# EAGLE design Servo_tester_rev1 (EAGLE 9.5.2)
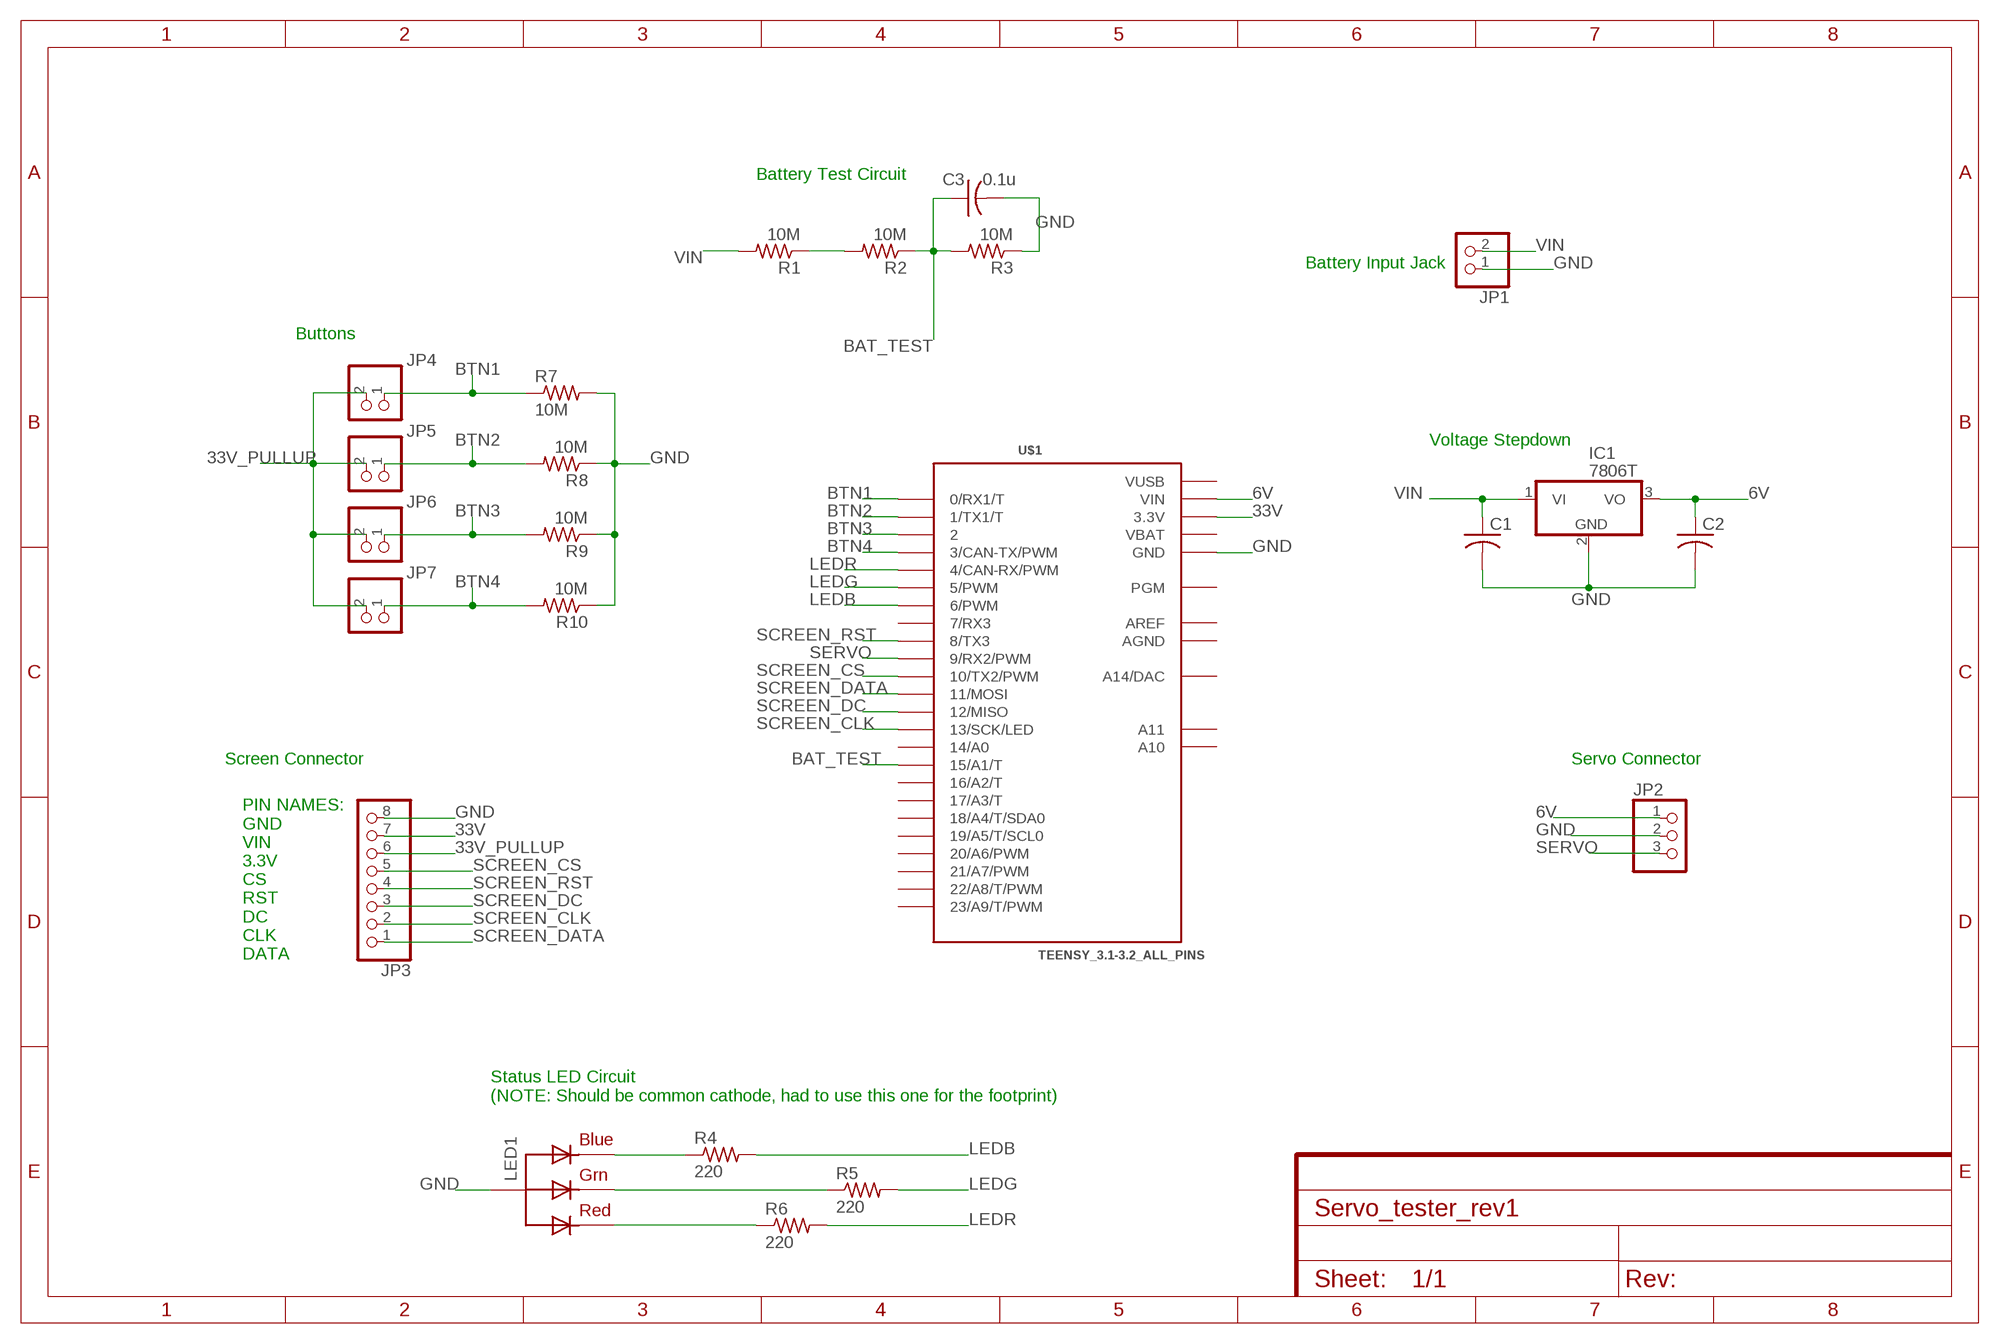
[diagram p0: schematic, sheet 1]

## Parts
C1  C-US050-024X044  [C050-024X044]
C2  C-US050-024X044  [C050-024X044]
C3  0.1u  C-US050-024X044  [C050-024X044]
IC1  7806T  [TO220H]
JP1  HEADER-1X2ROUND  [1X02_ROUND]
JP2  HEADER-1X3ROUND  [1X03_ROUND]
JP3  HEADER-1X870MIL  [1X08_ROUND_70]
JP4  HEADER-1X2ROUND  [1X02_ROUND]
JP5  HEADER-1X2ROUND  [1X02_ROUND]
JP6  HEADER-1X2ROUND  [1X02_ROUND]
JP7  HEADER-1X2ROUND  [1X02_ROUND]
LED1  RGBLED_CA-5MM  [LED5MMRGB]
R1  10M  R-US_0204/5  [0204/5]
R2  10M  R-US_0204/5  [0204/5]
R3  10M  R-US_0204/5  [0204/5]
R4  220  R-US_0204/5  [0204/5]
R5  220  R-US_0204/5  [0204/5]
R6  220  R-US_0204/5  [0204/5]
R7  10M  R-US_0204/5  [0204/5]
R8  10M  R-US_0204/5  [0204/5]
R9  10M  R-US_0204/5  [0204/5]
R10  10M  R-US_0204/5  [0204/5]
U$1  TEENSY_3.1-3.2_ALL_PINS  [TEENSY_3.0-3.2&LC_ALL_PINS]

## Nets
6V: C2.1 IC1.3(VO) JP2.1 U$1.VIN
33V: JP3.7 U$1.3.3V U$1.3.3V1(3.3V)
33V_PULLUP: JP3.6 JP4.2 JP5.2 JP6.2 JP7.2
BAT_TEST: C3.1 R2.1 R3.2 U$1.15/A1(15/A1/T)
BTN1: JP4.1 R7.1 U$1.0(0/RX1/T)
BTN2: JP5.1 R8.2 U$1.1(1/TX1/T)
BTN3: JP6.1 R9.2 U$1.2
BTN4: JP7.1 R10.2 U$1.3(3/CAN-TX/PWM)
GND: C1.2 C2.2 C3.2 IC1.2(GND) JP1.1 JP2.2 JP3.8 LED1.2(VCC) R3.1 R7.2 R8.1 R9.1 R10.1 U$1.GND U$1.GND1(GND)
LEDB: R4.2 U$1.6(6/PWM)
LEDG: R5.2 U$1.5(5/PWM)
LEDR: R6.2 U$1.4(4/CAN-RX/PWM)
N$13: LED1.1(RED) R6.1
N$14: LED1.4(BLUE) R4.1
N$15: LED1.3(GREEN) R5.1
N$19: R1.1 R2.2
SCREEN_CLK: JP3.2 U$1.13(13/SCK/LED)
SCREEN_CS: JP3.5 U$1.10(10/TX2/PWM)
SCREEN_DATA: JP3.1 U$1.11(11/MOSI)
SCREEN_DC: JP3.3 U$1.12(12/MISO)
SCREEN_RST: JP3.4 U$1.8(8/TX3)
SERVO: JP2.3 U$1.9(9/RX2/PWM)
VIN: C1.1 IC1.1(VI) JP1.2 R1.2
Unconnected: U$1.7(7/RX3) U$1.14/A0 U$1.16/A2(16/A2/T) U$1.17/A3(17/A3/T) U$1.18/A4(18/A4/T/SDA0) U$1.19/A5(19/A5/T/SCL0) U$1.20/A6(20/A6/PWM) U$1.21/A7(21/A7/PWM) U$1.22/A8(22/A8/T/PWM) U$1.23/A9(23/A9/T/PWM) U$1.A10 U$1.A11 U$1.PGM U$1.RESET/DAC(A14/DAC)

## Notes on the sheet
- Battery Test Circuit
- Battery Input Jack
- Buttons
- Voltage Stepdown
- Screen Connector | Servo Connector
- PIN NAMES:
  GND
  VIN
  3.3V
  CS
  RST
  DC
  CLK
  DATA
- Status LED Circuit
  (NOTE: Should be common cathode, had to use this one for the footprint)

## Power pins joined to a net without a drawn wire
AGND: U$1.AGND
AREF: U$1.AREF
VBAT: U$1.VBAT
VUSB: U$1.VUSB

## Library data of the parts
C1-C3 = adafruit:C-US: CAPACITOR, American symbol
IC1 = adafruit:78*: Positive VOLTAGE REGULATOR Added bigger pads to the TO-92 package
JP1 JP4-JP7 = microbuilder:HEADER-1X2: PIN HEADER
JP2 = microbuilder:HEADER-1X3: PIN HEADER
JP3 = microbuilder:HEADER-1X8: PIN HEADER
LED1 = adafruit:RGBLED_CA: RGB LED, common-anode 5MM Staggered pins 5mm Piranha package http://www.ladyada.net/library/pcb/eaglelibrary.html
R1-R10 = adafruit:R-US_: RESISTOR, American symbol
U$1 = Teensy_3_and_LC_Series_Boards_v1.4:TEENSY_3.1-3.2_ALL_PINS: Footprint for Teensy 3.1 or 3.2 board using all through-holes, i.e. the entire perimeter plus the 4 through-holes inboard (A10,A11,AREF, VUSB)

## Net classes
0 default: clearance 0.205 mm

## Board
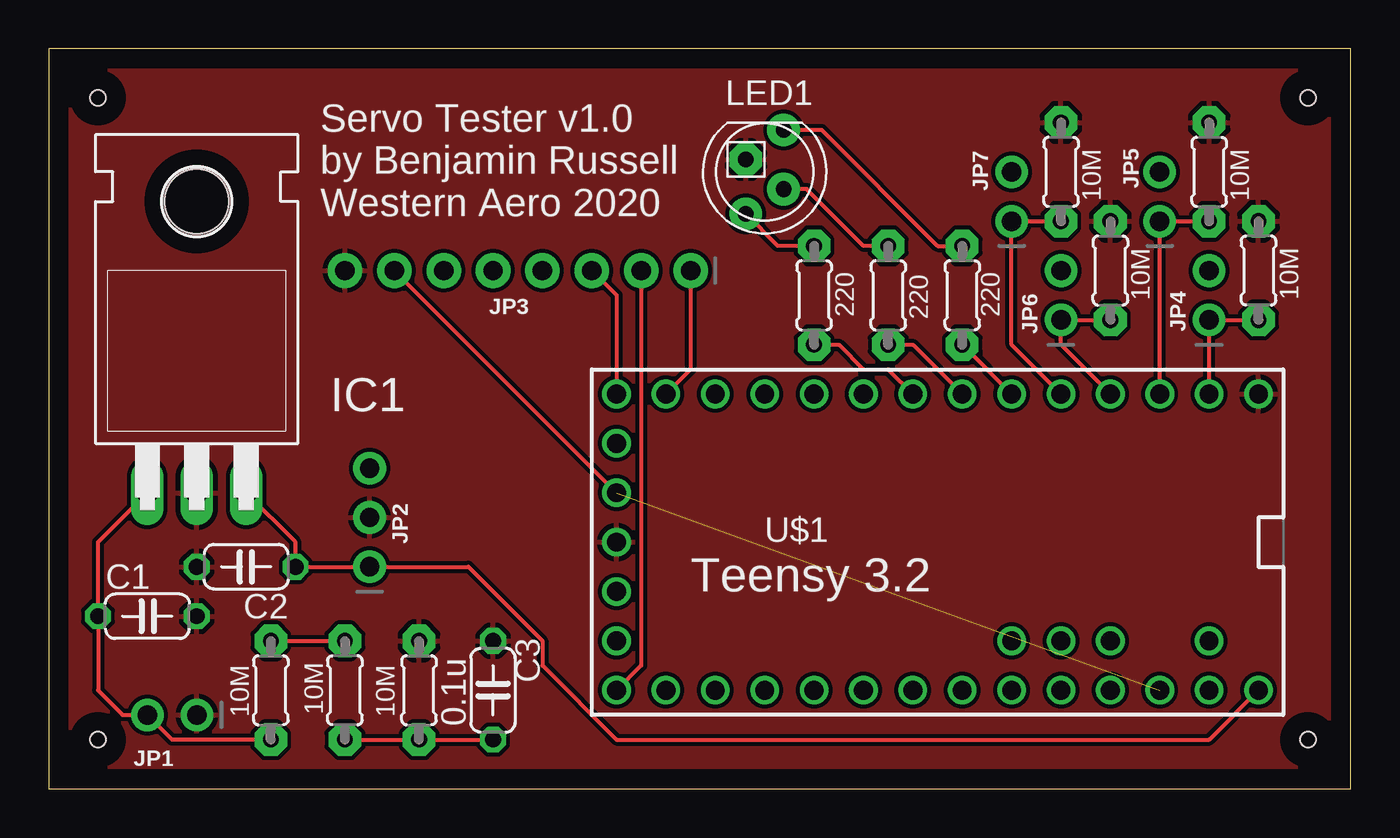
[diagram p1: board, top side]
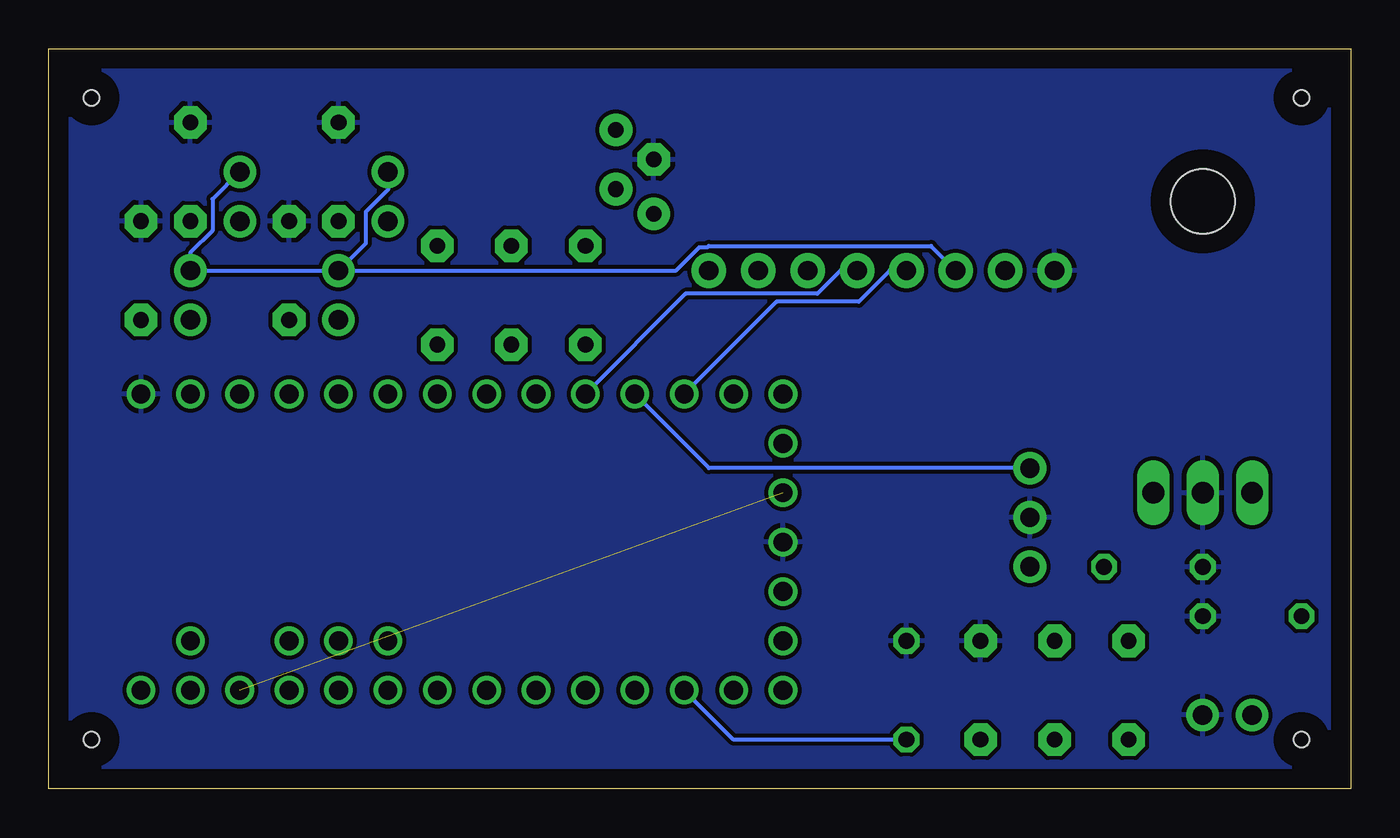
[diagram p2: board, bottom side, seen from below]

Size 66.98 x 38.09 mm. Coordinates in mm from the lower left corner, seen from the top.
Outline: 0,0 66.98,0 66.98,38.09 0,38.09 0,0
Copper layers (1*16): Top 0.035mm / dielectric 1.5mm / Bottom 0.035mm
Design rules "default *": minimum track width 8mil, minimum drill 0.35mm, track to track 6mil, track to pad 6mil, pad to pad 6mil, via to via 6mil, smd to smd 6mil, copper to edge 40mil, drill to drill 6mil, minimum pad ring 10mil, minimum via ring 8mil, stop-mask expansion 4mil, vias tented up to drill 0mil, thermal gap 10mil
Holes 0.8 mm at 2.54,35.56 64.77,35.56 64.77,2.54 2.54,2.54

### Footprints (pad centres in the part's own frame; a part is rotated, then mirrored left to right if it is on the bottom)
C050-024X044 = drill 0.813 octagon: 1 -2.54,0; 2 2.54,0
TO220H = drill 1.118 long: 1 -2.54,-10.16; 2 0,-10.16; 3 2.54,-10.16 | hole 3.302: 0,4.826
1X02_ROUND = drill 1 pad 1.676: 1 -1.27,0; 2 1.27,0
1X03_ROUND = drill 1 pad 1.676: 1 -2.54,0; 2 0,0; 3 2.54,0
1X08_ROUND_70 = drill 1 pad 1.778: 1 -8.89,0; 2 -6.35,0; 3 -3.81,0; 4 -1.27,0; 5 1.27,0; 6 3.81,0; 7 6.35,0; 8 8.89,0
LED5MMRGB = drill 0.8 pad 1.676: 1 -2.159,0.968; 3 0.889,0.968; 4 2.159,-0.968 | drill 0.8 pad 1.676 octagon: 2 -0.635,-0.968
0204/5 = drill 0.813 pad 1.676 octagon: 1 -2.54,0; 2 2.54,0
TEENSY_3.0-3.2&LC_ALL_PINS = drill 0.965: 0 -7.62,13.97; 1 -7.62,11.43; 2 -7.62,8.89; 3 -7.62,6.35; 3.3V 7.62,11.43; 3.3V1 -2.54,-16.51; 4 -7.62,3.81; 5 -7.62,1.27; 6 -7.62,-1.27; 7 -7.62,-3.81; 8 -7.62,-6.35; 9 -7.62,-8.89; 10 -7.62,-11.43; 11 -7.62,-13.97; 12 -7.62,-16.51; 13 7.62,-16.51; 14/A0 7.62,-13.97; 15/A1 7.62,-11.43; 16/A2 7.62,-8.89; 17/A3 7.62,-6.35; 18/A4 7.62,-3.81; 19/A5 7.62,-1.27; 20/A6 7.62,1.27; 21/A7 7.62,3.81; 22/A8 7.62,6.35; 23/A9 7.62,8.89; A10 5.08,6.35; A11 5.08,3.81; AGND 7.62,13.97; AREF 5.08,8.89; GND -7.62,16.51; GND1 0,-16.51; PGM 2.54,-16.51; RESET/DAC 5.08,-16.51; VBAT -5.08,-16.51; VIN 7.62,16.51; VUSB 5.08,13.97

### Placement (x,y rotation side)
C1  5.08,8.89 0 top
C2  10.16,11.43 180 top
C3  22.86,5.08 90 top
IC1  7.62,25.4 0 top
JP1  6.35,3.81 180 top
JP2  16.51,13.97 90 top
JP3  24.13,26.67 180 top
JP4  59.69,25.4 90 top
JP5  57.15,30.48 90 top
JP6  52.07,25.4 90 top
JP7  49.53,30.48 90 top
LED1  36.83,31.75 270 top
R1  11.43,5.08 270 top
R2  15.24,5.08 90 top
R3  19.05,5.08 270 top
R4  39.37,25.4 270 top
R5  43.18,25.4 270 top
R6  46.99,25.4 270 top
R7  62.23,26.67 90 top
R8  59.69,31.75 270 top
R9  54.61,26.67 270 top
R10  52.07,31.75 270 top
U$1  45.72,12.7 270 top

### Tracks (layer width: path | path; a pad name or v marks a point on that pad's centre or on a via)
6V
  Top 0.203: IC1.3 12.7,12.7 C2.1 JP2.1 21.59,11.43 25.4,7.62 25.4,6.35 29.21,2.54 59.69,2.54 U$1.VIN
33V  (1 unrouted)
  Top 0.203: JP3.7 U$1.3.3V1
33V_PULLUP
  Bottom 0.203: JP6.2 JP4.2 59.69,27.59 58.54,28.74 58.54,30.36 JP5.2 | JP6.2 34.71,26.67 33.52,27.87 33.09,27.87 33.02,27.94 21.59,27.94 JP3.6 | JP7.2 49.53,30.83 50.67,29.68 50.67,28.07 JP6.2
BAT_TEST
  Top 0.203: R2.1 R3.2 C3.1
  Bottom 0.203: C3.1 31.75,2.54 U$1.15/A1
BTN1
  Top 0.203: U$1.0 JP4.1 R7.1
BTN2
  Top 0.203: U$1.1 JP5.1 R8.2
BTN3
  Top 0.203: U$1.2 52.07,22.86 JP6.1 R9.2
BTN4
  Top 0.203: U$1.3 49.53,22.86 JP7.1 R10.2
GND
  pour Top: 0,38.1 68.58,38.1 68.58,0 0,0
  pour Bottom: 0,38.1 68.58,38.1 68.58,0 0,0
LEDB
  Top 0.203: R4.2 40.64,22.86 41.91,21.59 43.18,21.59 U$1.6
LEDG
  Top 0.203: R5.2 44.45,22.86 U$1.5
LEDR
  Top 0.203: R6.2 U$1.4
N$13
  Top 0.203: LED1.1 39.75,33.91 45.72,27.94 R6.1
N$14
  Top 0.203: R4.1 37.51,27.94 LED1.4
N$15
  Top 0.203: R5.1 41.91,27.94 38.99,30.86 LED1.3
N$19
  Top 0.203: R1.1 R2.2
SCREEN_CLK
  Top 0.203: U$1.13 30.48,6.35 JP3.2
SCREEN_CS
  Bottom 0.203: U$1.10 29.54,25.07 25.31,25.07 23.71,26.67 JP3.5
SCREEN_DATA
  Top 0.203: JP3.1 33.02,21.59 U$1.11
SCREEN_DC
  Top 0.203: JP3.3 29.21,25.4 U$1.12
SCREEN_RST
  Bottom 0.203: JP3.4 26.25,26.67 27.45,25.47 34.22,25.47 U$1.8
SERVO
  Bottom 0.203: JP2.3 33.02,16.51 U$1.9
VIN
  Top 0.203: IC1.1 2.54,12.7 C1.1 2.54,5.08 3.81,3.81 JP1.2 6.35,2.54 R1.2

### Text on the board
tNames: Servo Tester v1.0 / by Benjamin Russell / Western Aero 2020 | Teensy 3.2